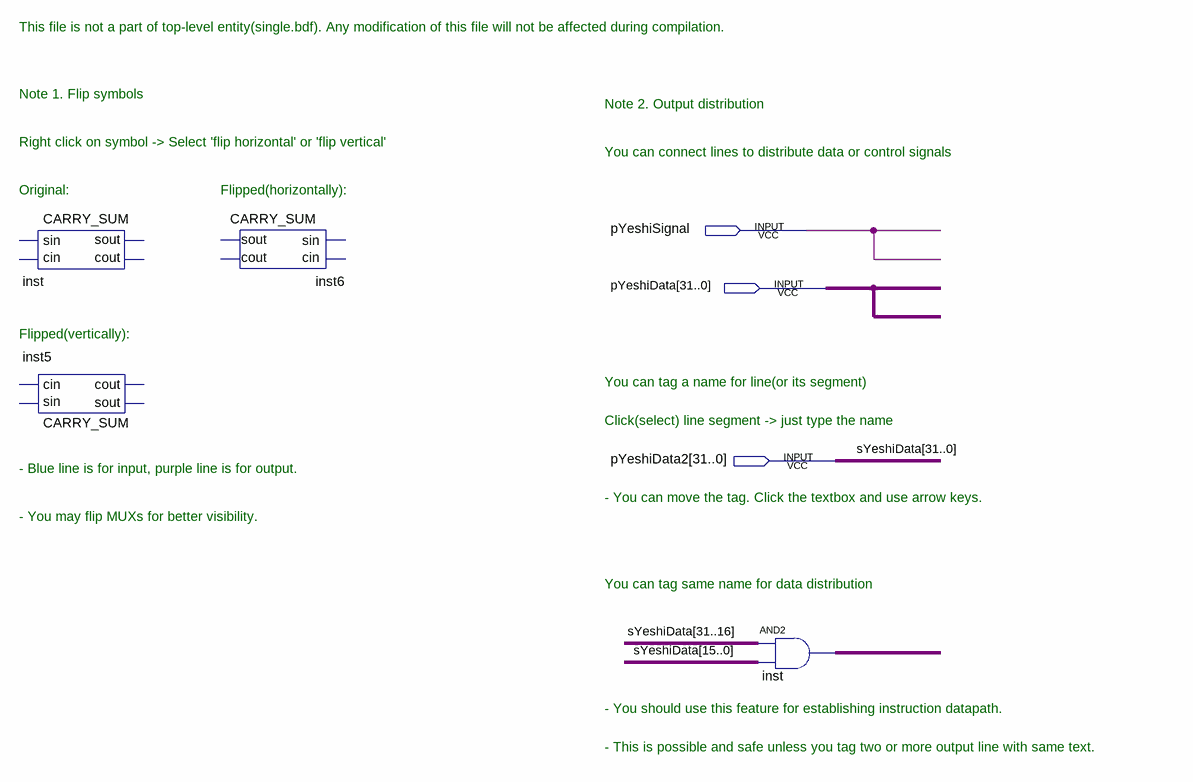
[diagram p0: schematic sheet]
// Quartus schematic yeshi.bdf as structural Verilog: 4 symbols, 3 pins
module yeshi (
  input  pYeshiSignal,
  input  [31:0] pYeshiData,
  input  [31:0] pYeshiData2
);

  wire [15:0] inst_out;

  CARRY_SUM inst ();  // open: sin, cin, sout, cout
  CARRY_SUM inst5 ();  // open: sin, cin, sout, cout
  CARRY_SUM inst6 ();  // open: sin, cin, sout, cout
  assign inst_out = pYeshiData2[31:16] & pYeshiData2[15:0];  // AND2 inst, 16 bits wide

  // Other names for the same wires on the sheet: sYeshiData[31:0] = pYeshiData2

  // Notes on the sheet:
  //   This file is not a part of top-level entity(single.bdf). Any modification of this file will not be affected during compilation.
  //   Note 1. Flip symbols
  //   Note 2. Output distribution
  //   Right click on symbol -> Select 'flip horizontal' or 'flip vertical'
  //   You can connect lines to distribute data or control signals
  //   Original:
  //   Flipped(horizontally):
  //   Flipped(vertically):
  //   You can tag a name for line(or its segment)
  //   Click(select) line segment -> just type the name
  //   - Blue line is for input, purple line is for output.
  //   - You can move the tag. Click the textbox and use arrow keys.
  //   - You may flip MUXs for better visibility.
  //   You can tag same name for data distribution
  //   - You should use this feature for establishing instruction datapath.
  //   - This is possible and safe unless you tag two or more output line with same text.
endmodule
